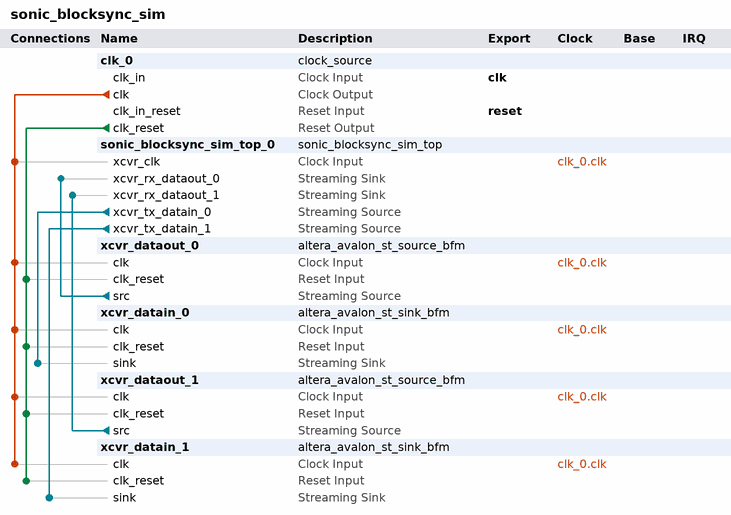
[diagram p0: system contents]
# Platform Designer (Qsys) system sonic_blocksync_sim
# Parameters at their usual value, and those the tool derives, are not listed.
package require -exact qsys 11.0
create_system sonic_blocksync_sim
set_project_property DEVICE_FAMILY STRATIXIV

add_instance clk_0 clock_source 11.0
set_instance_parameter_value clk_0 clockFrequency 257812500

add_instance sonic_blocksync_sim_top_0 sonic_blocksync_sim_top 1.0
set_instance_parameter_value sonic_blocksync_sim_top_0 PIPE_MODE_SIM 1
set_instance_parameter_value sonic_blocksync_sim_top_0 TEST_LEVEL 1
set_instance_parameter_value sonic_blocksync_sim_top_0 NUM_CONNECTED_LANES 8
set_instance_parameter_value sonic_blocksync_sim_top_0 FAST_COUNTERS 1

add_instance xcvr_dataout_0 altera_avalon_st_source_bfm 11.0
set_instance_parameter_value xcvr_dataout_0 USE_PACKET 0
set_instance_parameter_value xcvr_dataout_0 USE_CHANNEL 0
set_instance_parameter_value xcvr_dataout_0 USE_ERROR 0
set_instance_parameter_value xcvr_dataout_0 USE_READY 0
set_instance_parameter_value xcvr_dataout_0 USE_VALID 0
set_instance_parameter_value xcvr_dataout_0 USE_EMPTY 0
set_instance_parameter_value xcvr_dataout_0 ST_SYMBOL_W 40
set_instance_parameter_value xcvr_dataout_0 ST_NUMSYMBOLS 1
set_instance_parameter_value xcvr_dataout_0 ST_CHANNEL_W 1
set_instance_parameter_value xcvr_dataout_0 ST_ERROR_W 1
set_instance_parameter_value xcvr_dataout_0 ST_MAX_CHANNELS 1

add_instance xcvr_datain_0 altera_avalon_st_sink_bfm 11.0
set_instance_parameter_value xcvr_datain_0 USE_PACKET 0
set_instance_parameter_value xcvr_datain_0 USE_CHANNEL 0
set_instance_parameter_value xcvr_datain_0 USE_ERROR 0
set_instance_parameter_value xcvr_datain_0 USE_READY 0
set_instance_parameter_value xcvr_datain_0 USE_VALID 0
set_instance_parameter_value xcvr_datain_0 USE_EMPTY 0
set_instance_parameter_value xcvr_datain_0 ST_SYMBOL_W 40
set_instance_parameter_value xcvr_datain_0 ST_NUMSYMBOLS 1
set_instance_parameter_value xcvr_datain_0 ST_CHANNEL_W 1
set_instance_parameter_value xcvr_datain_0 ST_ERROR_W 1
set_instance_parameter_value xcvr_datain_0 ST_READY_LATENCY 0
set_instance_parameter_value xcvr_datain_0 ST_MAX_CHANNELS 1

add_instance xcvr_dataout_1 altera_avalon_st_source_bfm 11.0
set_instance_parameter_value xcvr_dataout_1 USE_PACKET 0
set_instance_parameter_value xcvr_dataout_1 USE_CHANNEL 0
set_instance_parameter_value xcvr_dataout_1 USE_ERROR 0
set_instance_parameter_value xcvr_dataout_1 USE_READY 0
set_instance_parameter_value xcvr_dataout_1 USE_VALID 0
set_instance_parameter_value xcvr_dataout_1 USE_EMPTY 0
set_instance_parameter_value xcvr_dataout_1 ST_SYMBOL_W 40
set_instance_parameter_value xcvr_dataout_1 ST_NUMSYMBOLS 1
set_instance_parameter_value xcvr_dataout_1 ST_CHANNEL_W 1
set_instance_parameter_value xcvr_dataout_1 ST_ERROR_W 1
set_instance_parameter_value xcvr_dataout_1 ST_MAX_CHANNELS 1

add_instance xcvr_datain_1 altera_avalon_st_sink_bfm 11.0
set_instance_parameter_value xcvr_datain_1 USE_PACKET 0
set_instance_parameter_value xcvr_datain_1 USE_CHANNEL 0
set_instance_parameter_value xcvr_datain_1 USE_ERROR 0
set_instance_parameter_value xcvr_datain_1 USE_READY 0
set_instance_parameter_value xcvr_datain_1 USE_VALID 0
set_instance_parameter_value xcvr_datain_1 USE_EMPTY 0
set_instance_parameter_value xcvr_datain_1 ST_SYMBOL_W 40
set_instance_parameter_value xcvr_datain_1 ST_NUMSYMBOLS 1
set_instance_parameter_value xcvr_datain_1 ST_CHANNEL_W 1
set_instance_parameter_value xcvr_datain_1 ST_ERROR_W 1
set_instance_parameter_value xcvr_datain_1 ST_READY_LATENCY 0
set_instance_parameter_value xcvr_datain_1 ST_MAX_CHANNELS 1

# connections
add_connection clk_0.clk sonic_blocksync_sim_top_0.xcvr_clk clock
add_connection clk_0.clk xcvr_datain_0.clk clock
add_connection clk_0.clk xcvr_datain_1.clk clock
add_connection clk_0.clk xcvr_dataout_0.clk clock
add_connection clk_0.clk xcvr_dataout_1.clk clock
add_connection clk_0.clk_reset xcvr_datain_0.clk_reset reset
add_connection clk_0.clk_reset xcvr_datain_1.clk_reset reset
add_connection clk_0.clk_reset xcvr_dataout_0.clk_reset reset
add_connection clk_0.clk_reset xcvr_dataout_1.clk_reset reset
add_connection sonic_blocksync_sim_top_0.xcvr_tx_datain_0 xcvr_datain_0.sink avalon_streaming
add_connection sonic_blocksync_sim_top_0.xcvr_tx_datain_1 xcvr_datain_1.sink avalon_streaming
add_connection xcvr_dataout_0.src sonic_blocksync_sim_top_0.xcvr_rx_dataout_0 avalon_streaming
add_connection xcvr_dataout_1.src sonic_blocksync_sim_top_0.xcvr_rx_dataout_1 avalon_streaming

# exported interfaces
add_interface clk clock sink
set_interface_property clk EXPORT_OF clk_0.clk_in
add_interface reset reset sink
set_interface_property reset EXPORT_OF clk_0.clk_in_reset

save_system sonic_blocksync_sim.qsys
